# Altium schematic sheet lab1_zasetskiy_usb_spi.SchDoc: =title_line_1 + title_line_2
size 594 x 420 mm; SheetNumber: n
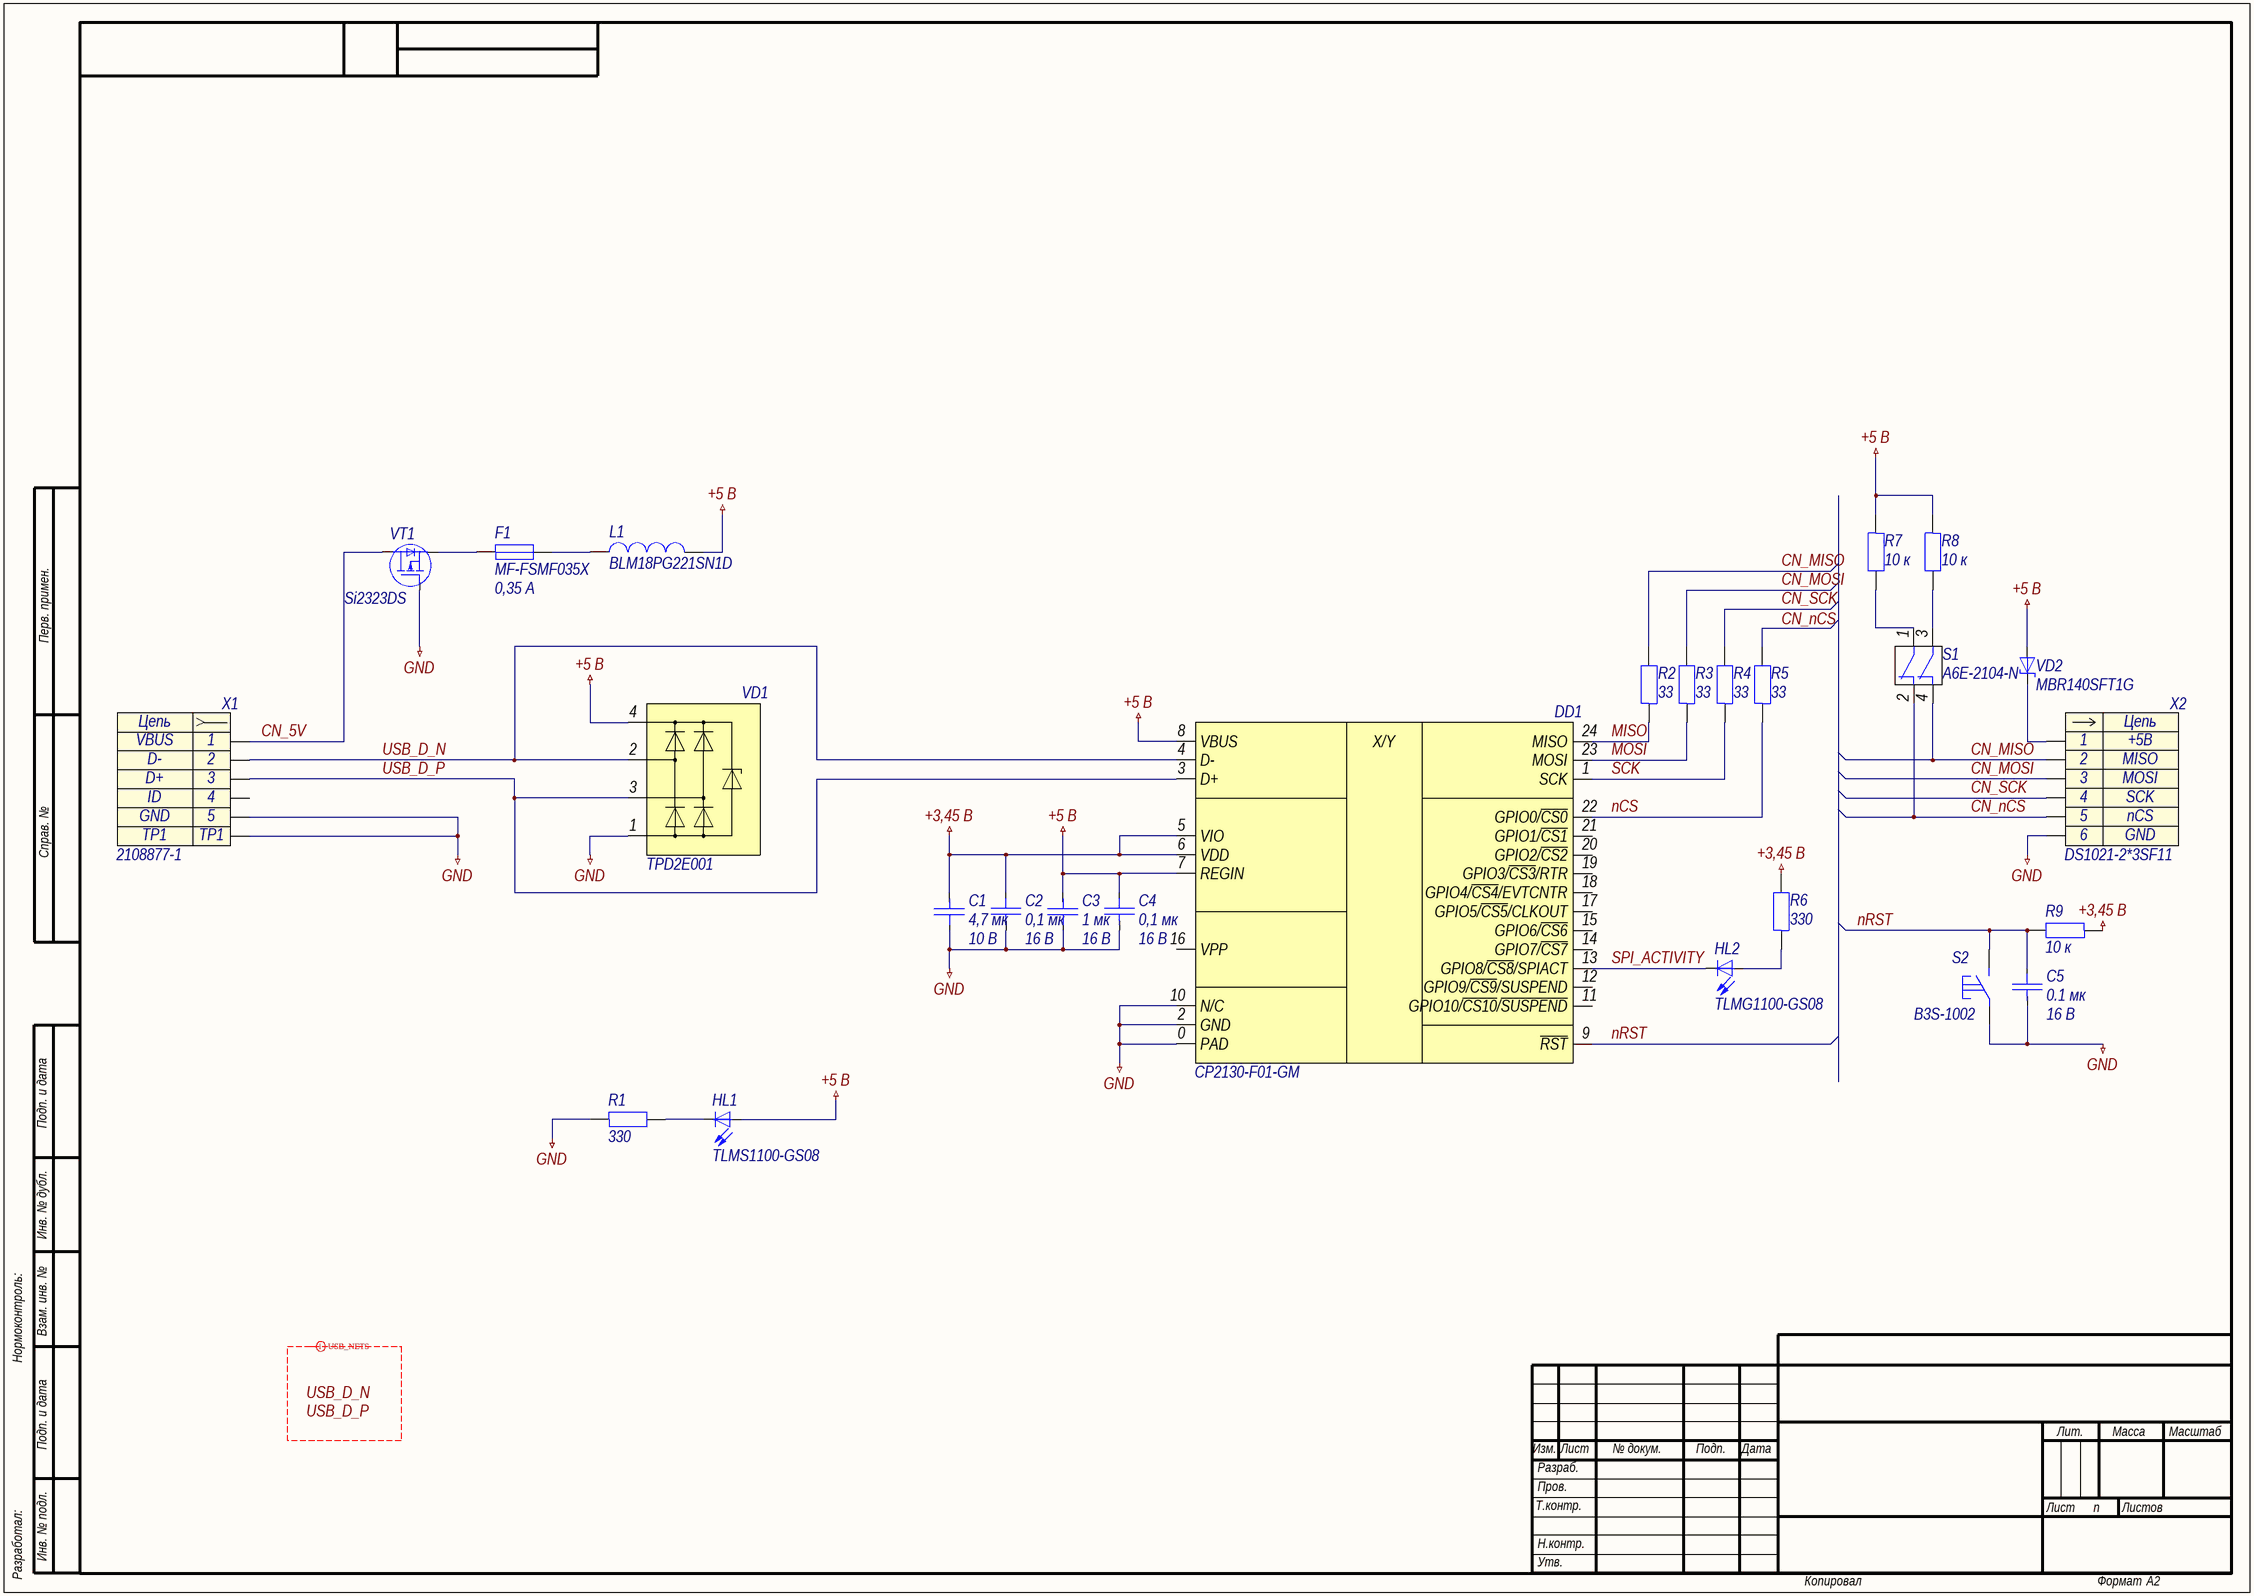
[diagram p0: lab1_zasetskiy_usb_spi.SchDoc]

## Parts
C1  4,7 мк  Напряжение: 10 В  [C0402]
C2  0,1 мк  Напряжение: 16 В  [C0402]
C3  1 мк  Напряжение: 16 В  [C0402]
C4  0,1 мк  Напряжение: 16 В  [C0402]
C5  0.1 мк  Напряжение: 16 В  [C0402]
DD1  CP2130-F01-GM  [QFN-24-400X400X80]
F1  MF-FSMF035X  Hold Current: 0,35 А  [F0603]
HL1  TLMS1100-GS08  [LED]
HL2  TLMG1100-GS08  [LED_GREEN]
L1  BLM18PG221SN1D  [BLM-2-0603]
R1  330  [R0603]
R2  33  [R0603]
R3  33  [R0603]
R4  33  [R0603]
R5  33  [R0603]
R6  330  [R0603]
R7  10 к  [R0603]
R8  10 к  [R0603]
R9  10 к  [R0603]
S1  A6E-2104-N  [A6E-2104-N]
S2  B3S-1002  [B3S-1002]
VD1  TPD2E001  [SOP]
VD2  MBR140SFT1G  [DIODE]
VT1  Si2323DS  [SOT-23-3]
X1  2108877-1  [2108877-1]
X2  DS1021-2*3SF11  [PLS_2.54_2x3]

## Nets
+3,45 В: C1.2 C2.1 DD1.5(VIO) DD1.6(VDD) R6.2 R9.1
+5 В: C3.2 C4.1 DD1.7(REGIN) DD1.8(VBUS) HL1.1(A) L1.2 R7.1 R8.1 VD1.4 VD2.1(A)
GND: C1.1 C2.2 C3.1 C4.2 C5.2 DD1.0(PAD) DD1.2(GND) DD1.10(N/C) R1.1 S2.1 VD1.1 VT1.1(G) X1.5 X1.TP1 X2.6
CN_5V: VT1.3(D) X1.1
CN_MISO: R2.2 S1.4 X2.2
CN_MOSI: R3.2 X2.3
CN_nCS: S1.2 X2.5
CN_SCK: R4.2 X2.4
MISO: DD1.24(MISO) R2.1
MOSI: DD1.23(MOSI) R3.1
nCS: DD1.22(GPIO0/~{CS0}) R5.1
nRST: C5.1 DD1.9(~{RST}) R9.2 S2.2
SCK: DD1.1(SCK) R4.1
SPI_ACTIVITY: DD1.13(GPIO8/~{CS8}/SPIACT) HL2.2(K)
USB_D_N: DD1.4(D-) VD1.2 X1.2
USB_D_P: DD1.3(D+) VD1.3 X1.3
NetF1_1: F1.1 VT1.2(S)
NetF1_2: F1.2 L1.1
NetHL1_2: HL1.2(K) R1.2
NetHL2_1: HL2.1(A) R6.1
NetR7_2: R7.2 S1.1
NetR8_2: R8.2 S1.3
NetVD2_2: VD2.2(K) X2.1

Not connected (* = marked no-connect by the designer): DD1 11(GPIO10/~{CS10}/~{SUSPEND}) 12(GPIO9/~{CS9}/SUSPEND) 14(GPIO7/~{CS7}) 15(GPIO6/~{CS6}) 16(VPP) 17(GPIO5/~{CS5}/CLKOUT) 18(GPIO4/~{CS4}/EVTCNTR) 19(GPIO3/~{CS3}/RTR) 20(GPIO2/~{CS2}) 21(GPIO1/~{CS1}); R5 2; X1 4

## Layout directives
differential pair; differential pair class USB_SIGNALS: USB_D_N, USB_D_P

## Notes on the sheet
- Labels drawn without touching a wire or pin: CN_nCS, USB_D_N, USB_D_P
- Перв. примен.
- Справ. №
- Подп. и дата
- Инв. № дубл.
- Нормоконтроль:
- Взам. инв. №
- Изм.
- Лист
- № докум.
- Подп.
- Дата
- Лит.
- Масса
- Масштаб
- Т.контр.
- Пров.
- Разраб.
- Листов
- Разработал:
- Инв. № подл.
- Н.контр.
- Утв.
- Копировал
- Формат
- А2
- (in symbol dd0003) X/Y
- (in symbol x0001) Цепь
- (in symbol x0002) Цепь; VBUS; D-; D+; ID; GND

## Library data of the parts
C1 = c0002: =Описание; ID: c0002; Фамилия: Засецкий; Описание: Конденсатор чип 0402 4,7 мкФ 10 В ±10 %; Наименование: CL05A475KP5NRNC; Производитель: Samsung electro-mechanics; Отклонение: ±10 %; Рабочие температуры: от -55 °С до +85 °С; Корпус: 0402; Примечание: X5R; Номинал: 4,7 мк; Номинальное напряжение: 10 В; HelpURL: http://product.samsungsem.com/mlcc/CL05A475KP5NRN.do
C2 C4 C5 = c0003: =Описание; ID: c0003; Фамилия: Засецкий; Описание: Конденсатор чип 0402 0,1 мкФ 16 В ±5 %; Наименование: CL05B104JO5NNNC; Производитель: Samsung electro-mechanics; Отклонение: ±5 %; Рабочие температуры: от -55 °С до +125 °С; Корпус: 0402; Примечание: X7R; Номинальное напряжение: 16 В; HelpURL: http://product.samsungsem.com/mlcc/CL05B104JO5NNN.do
  C2 C4: Номинал: 0,1 мк
  C5: Номинал: 0.1 мк
C3 = c0004: =Описание; ID: c0004; Фамилия: Засецкий; Описание: Конденсатор чип 0402 1 мкФ 16 В ±10 %; Наименование: CL05A475KP5NRNC; Производитель: Samsung electro-mechanics; Отклонение: ±10 %; Рабочие температуры: от -55 °С до +85 °С; Корпус: 0402; Примечание: X5R; Номинал: 1 мк; Номинальное напряжение: 16 В; HelpURL: http://product.samsungsem.com/mlcc/CL05A105KO5NNN.do
DD1 = dd0003: =Описание; ID: dd0003; Фамилия: Засецкий; Описание: Преобразователь USB-SPI; Производитель: Silicon Laboratories; Корпус: QFN-24; Наименование: CP2130-F01-GM; HelpURL: https://www.silabs.com/interface/usb-bridges/classic/device.cp2130
F1 = f0001: =Описание; ID: f0001; Фамилия: Засецкий; Описание: Плавкий предохранитель 0,35 А; Производитель: Bourns; Максимальное напряжение: 6 В; Максимальный ток: 40 А; Рабочие температуры: от –40 °С до +85 °С; Корпус: 0603; Наименование: MF-FSMF035X; Рабочий ток: 0,35 А; HelpURL: https://www.bourns.com/products/circuit-protection/resettable-fuses-multifuse-pptc/product/MF-FSMF
HL1 = hl0001: =Описание; ID: hl0001; Фамилия: Засецкий; Описание: Светодиод красный чип 0603; Производитель: Vishay; Рабочие температуры: от -40 °С до +100 °С; Номинальный ток: 30 мА; Корпус: 0603; Примечание: Красный; Наименование: TLMS1100-GS08; HelpURL: https://www.vishay.com/docs/83173/tlmb1100.pdf
HL2 = hl0002: =Описание; ID: hl0002; Фамилия: Засецкий; Описание: Светодиод зелёный чип 0603; Производитель: Vishay; Рабочие температуры: от -40 °С до +100 °С; Номинальный ток: 30 мА; Корпус: 0603; Примечание: Зелёный; Наименование: TLMG1100-GS08; HelpURL: https://www.vishay.com/docs/83173/tlmb1100.pdf
L1 = l0002: =Описание; ID: l0002; Фамилия: Самарин; Описание: Ферритовая бусина 220 Ом ±25 %; Производитель: Murata Manufacturing Co., Ltd.; Сопротивление, 100 МГц: 220 Ом; Отклонение, 100 МГц: ±25 %; Сопротивление при постоянном токе: 0,1 Ом; Рабочие температуры: от –55 °С до +125 °С; Корпус: 0603; Наименование: BLM18PG221SN1D; HelpURL: https://www.murata.com/en-global/products/productdetail?partno=BLM18PG221SN1%23
R1 R6 = r0004: =Описание; ID: r0004; Фамилия: Засецкий; Описание: Резистор чип 0603 330 Ом 0,1 Вт ±1 %; Наименование: RC0603FR-07330RL; Производитель: Yageo; Отклонение: ±1 %; Номинальное напряжение: 50 В; Рабочие температуры: от -50 °С до +150 °С; Номинальный ток: 1 А; Корпус: 0603; Номинал: 330; HelpURL: http://www.yageo.ru/pdf/RC0603.pdf
R2-R5 = r0007: =Описание; ID: r0007; Фамилия: Засецкий; Описание: Резистор чип 0603 33 Ом 0,1 Вт ±1 %; Наименование: RC0603FR-0733RL; Производитель: Yageo; Отклонение: ±1 %; Номинальное напряжение: 50 В; Рабочие температуры: от -50 °С до +150 °С; Номинальный ток: 1 А; Корпус: 0603; Номинал: 33; HelpURL: http://www.yageo.ru/pdf/RC0603.pdf
R7-R9 = r0006: =Описание; ID: r0006; Фамилия: Засецкий; Описание: Резистор чип 0603 10 кОм 0,1 Вт ±1 %; Наименование: RC0603FR-0710KL; Производитель: Yageo; Отклонение: ±1 %; Номинальное напряжение: 50 В; Рабочие температуры: от -50 °С до +150 °С; Номинальный ток: 1 А; Корпус: 0603; Номинал: 10 к; HelpURL: http://www.yageo.ru/pdf/RC0603.pdf
S1 = s0004: =Описание; ID: s0004; Фамилия: Засецкий; Описание: 2-х позиционный движковый переключатель; Производитель: OMRON Corporation; Ток нагрузки: 25 мА @ 24 В; Сопротивление контакта: 200 мОм; Количество контактов: 4; Рабочие температуры: от –20 °С до +70 °С; Промывка: Запрещена; Корпус: 6,44 x 9,90 x 7,05; Наименование: A6E-2104-N; HelpURL: https://components.omron.com/product-detail?partId=476
S2 = s0003: =Описание; ID: s0003; Фамилия: Засецкий; Описание: Тактовая кнопка поверхностного монтажа; Производитель: OMRON Corporation; Ток нагрузки: 50 мА @ 24 В; Сопротивление контакта: 100 мОм; Количество контактов: 4; Рабочие температуры: от –20 °С до +70 °С; Промывка: Разрешена; Корпус: 6,00 x 6,00 x 4,30; Наименование: B3S-1002; HelpURL: https://components.omron.com/product-detail?partId=468
VD1 = pr0002: ID: pr0002; Фамилия: Засецкий; Описание: Диодная двухканальная сборка для ESD защиты; Производитель: Texas Instruments; Рабочие температуры: от -65 °С до +150 °С; Наименование: TPD2E001; Корпус: SOP; HelpURL: https://www.ti.com/lit/ds/symlink/tpd2e001.pdf?ts=1603292129413&ref_url=https%253A%252F%252Fwww.ti.com%252Finterface%252Fcircuit-protection%252Fesd-protection-and-tvs-surge-diodes%252Fproducts.html
VD2 = di0001: =Описание; ID: di0001; Фамилия: Засецкий; Описание: Диод Шоттки; Производитель: ON semiconductor; Номинальное напряжение: 40 В; Рабочие температуры: от -55 °С до +125 °С; Номинальный ток: 2 А; Корпус: SOD−123FL; Наименование: MBR140SFT1G; HelpURL: https://www.onsemi.com/pub/Collateral/MBR140SFT1-D.PDF
VT1 = vt0003: =Описание; ID: vt0003; Фамилия: Засецкий; Описание: Транзистор полевой N-канальный 20 В 4,2 А; Производитель: Vishay Intertechnology, Inc.; Напряжение затвор — исток: ±12 В; Напряжение сток — исток: –20 В; Ток стока: 4,7 А; Сопротивление сток — исток: 0,068 Ом; Рабочие температуры: от –55 °С до +150 °С; Наименование: Si2323DS; Корпус: SOT-23-3; HelpURL: https://www.vishay.com/ppg?72024
X1 = x0002: =Описание; ID: x0002; Фамилия: Засецкий; Описание: Разъём micro USB-B; Наименование: 2108877-1
X2 = x0001: =Описание; Contact_05: nCS; Фамилия: Засецкий; Описание: Разъём штыревой 2x3 контактов; Contact_01: +5В; Contact_02: MISO; Contact_03: MOSI; Contact_04: SCK; Contact_06: GND; Наименование: DS1021-2*3SF11